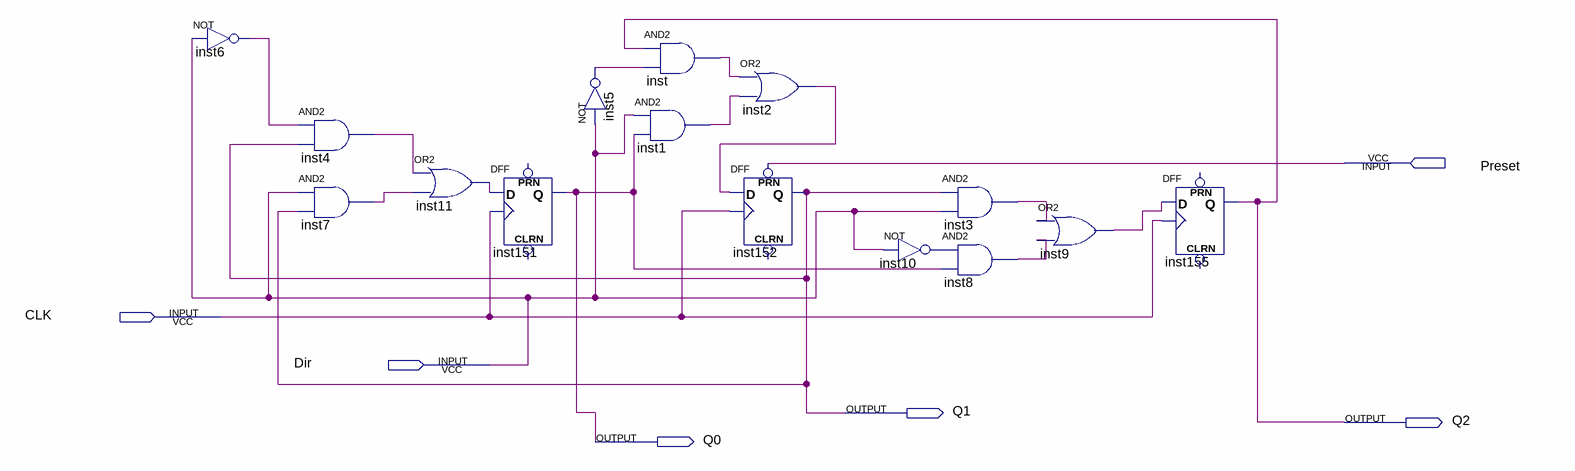
[diagram p0: schematic sheet]
// Quartus schematic CarRegisters.bdf as structural Verilog: 15 symbols, 6 pins
module CarRegisters (
  input  Preset,
  input  CLK,
  input  Dir,
  output Q1,
  output Q2,
  output Q0
);

  wire inst1_out, inst2_out, inst3_out, inst4_out, inst5_out, inst6_out, inst7_out, inst8_out, inst9_out,
       inst10_out, inst11_out, inst_out;

  not inst6 (inst6_out, Dir);
  and inst4 (inst4_out, inst6_out, Q1);
  and inst7 (inst7_out, Dir, Q1);
  or inst11 (inst11_out, inst4_out, inst7_out);
  DFF inst151 (.CLK(CLK), .D(inst11_out), .Q(Q0));  // open: CLRN, PRN
  not inst5 (inst5_out, Dir);
  and inst1 (inst1_out, Dir, Q0);
  and inst (inst_out, Q2, inst5_out);
  or inst2 (inst2_out, inst_out, inst1_out);
  DFF inst152 (.CLK(CLK), .D(inst2_out), .PRN(Preset), .Q(Q1));  // open: CLRN
  and inst3 (inst3_out, Q1, Dir);
  and inst8 (inst8_out, inst10_out, Q0);
  not inst10 (inst10_out, Dir);
  or inst9 (inst9_out, inst3_out, inst8_out);
  DFF inst155 (.CLK(CLK), .D(inst9_out), .Q(Q2));  // open: CLRN, PRN
endmodule
